# EAGLE design EthernetBoard (EAGLE 5.11)
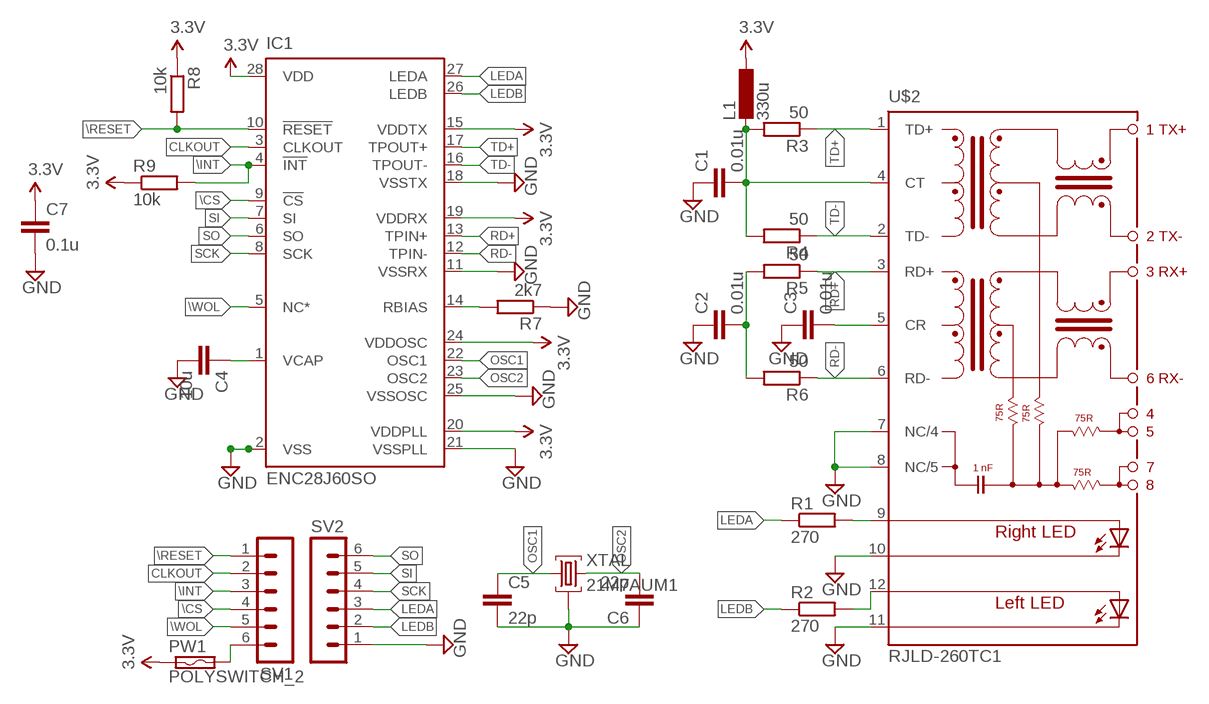
[diagram p0: schematic, sheet 1]

## Parts
C1  0.01u  C-EUC3216  [C3216]
C2  0.01u  C-EUC3216  [C3216]
C3  0.01u  C-EUC3216  [C3216]
C4  10u  C-EUC3216  [C3216]
C5  22p  C-EUC3216  [C3216]
C6  22p  C-EUC3216  [C3216]
C7  0.1u  C-EUC3216  [C3216]
IC1  ENC28J60SO  [SO28W]
L1  330u  L-EUL3216C  [L3216C]
PW1  POLYSWITCH_2  [0204/5]
R1  270  R-EU_M3216  [M3216]
R2  270  R-EU_M3216  [M3216]
R3  50  R-EU_M3216  [M3216]
R4  50  R-EU_M3216  [M3216]
R5  50  R-EU_M3216  [M3216]
R6  50  R-EU_M3216  [M3216]
R7  2k7  R-EU_M3216  [M3216]
R8  10k  R-EU_M3216  [M3216]
R9  10k  R-EU_M3216  [M3216]
SV1  MA06-1  [MA06-1]
SV2  MA06-1  [MA06-1]
U$2  RJLD-260TC1  [RJLD-260TC1]
XTAL  21M7AUM1  [UM1]

## Nets
3.3V [power]: C7.1 IC1.15(VDDTX) IC1.19(VDDRX) IC1.20(VDDPLL) IC1.24(VDDOSC) IC1.28(VDD) L1.1 PW1.1 R8.1 R9.1
\CS: IC1.9(!CS) SV1.4
\INT: IC1.4(!INT) R9.2 SV1.3
\RESET: IC1.10(!RESET) R8.2 SV1.1
\WOL: IC1.5(NC*) SV1.5
CLKOUT: IC1.3(CLKOUT) SV1.2
GND [power]: C1.1 C2.1 C3.1 C4.2 C5.2 C6.1 C7.2 IC1.2(VSS) IC1.11(VSSRX) IC1.18(VSSTX) IC1.21(VSSPLL) IC1.25(VSSOSC) R7.1 SV2.1 U$2.7(NC/4) U$2.8(NC/5) U$2.10(C-R) U$2.11(C-L) XTAL.2
LEDA: IC1.27(LEDA) R1.1 SV2.3
LEDB: IC1.26(LEDB) R2.1 SV2.2
N$1: R1.2 U$2.9(A-R)
N$2: R2.2 U$2.12(AL)
N$3: C3.2 U$2.5(CR)
N$4: IC1.14(RBIAS) R7.2
N$5: C1.2 L1.2 R3.2 R4.2 U$2.4(CT)
N$6: C2.2 R5.2 R6.2
N$7: C4.1 IC1.1(VCAP)
N$8 [power]: PW1.2 SV1.6
OSC1: C5.1 IC1.22(OSC1) XTAL.1
OSC2: C6.2 IC1.23(OSC2) XTAL.3
RD+: IC1.13(TPIN+) R5.1 U$2.3(RD+)
RD-: IC1.12(TPIN-) R6.1 U$2.6(RD-)
SCK: IC1.8(SCK) SV2.4
SI: IC1.7(SI) SV2.5
SO: IC1.6(SO) SV2.6
TD+: IC1.17(TPOUT+) R3.1 U$2.1(TD+)
TD-: IC1.16(TPOUT-) R4.1 U$2.2(TD-)

## Library data of the parts
C1-C7 = rcl:C-EU: CAPACITOR, European symbol
IC1 = microchip-6:ENC28J60: Stand-Alone Ethernet Controller with SPI Interface Source: http://ww1.microchip.com/downloads/en/DeviceDoc/39662c.pdf
L1 = rcl:L-EU: INDUCTOR, European symbol
PW1 = myparts:POLYSWITCH_2
R1-R9 = rcl:R-EU_: RESISTOR, European symbol
SV1 SV2 = con-lstb:MA06-1: PIN HEADER; OC_FARNELL: unknown; OC_NEWARK: unknown
U$2 = myparts:RJLD-260TC1
XTAL = crystal:21M*A: Monolithic Crystal Filters Source: www.vanlong.com; OC_FARNELL: unknown; OC_NEWARK: unknown

## Net classes
1 power: width 0.254 mm

## Board
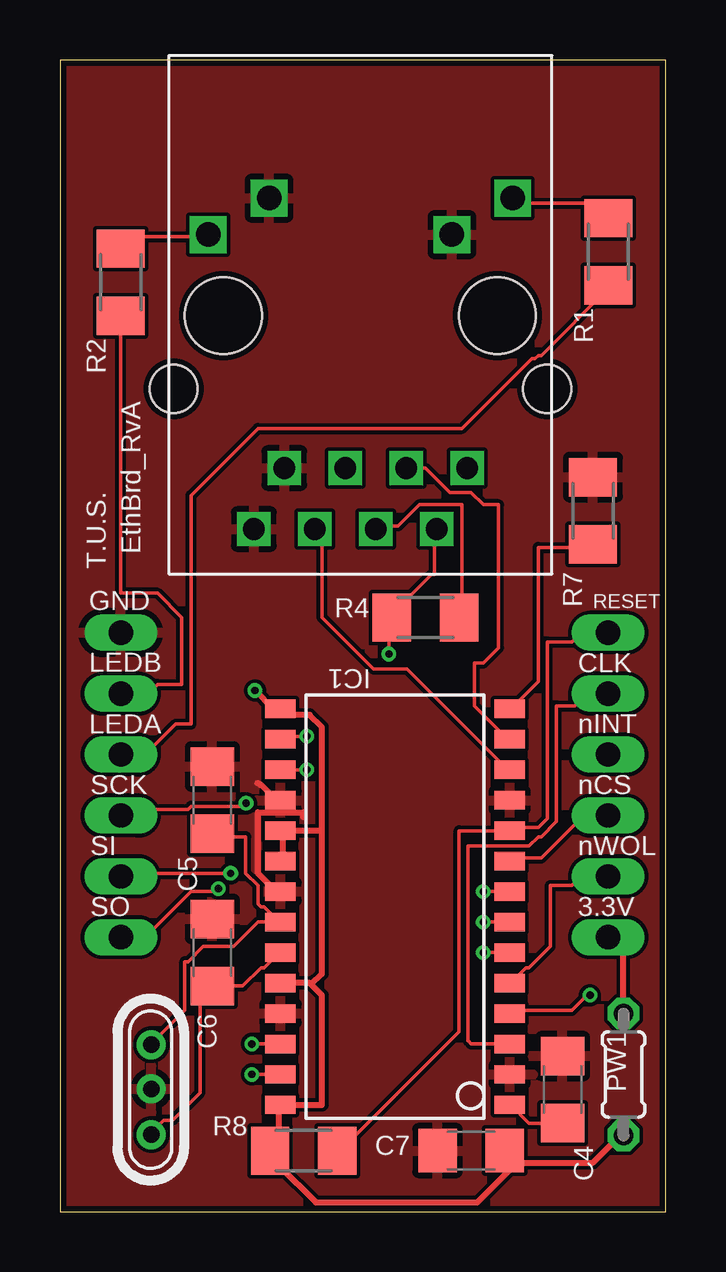
[diagram p1: board, top side]
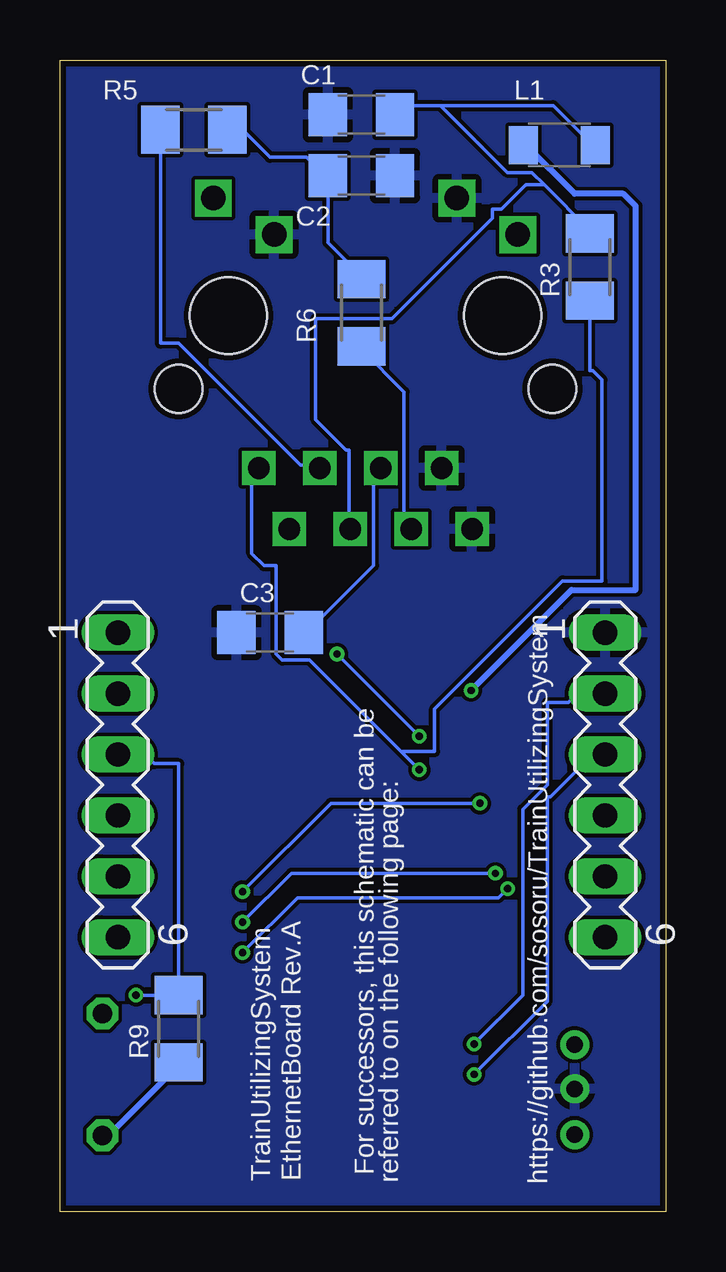
[diagram p2: board, bottom side, seen from below]

Size 25.27 x 48 mm. Coordinates in mm from the lower left corner, seen from the top.
Outline: 0,0 25.27,0 25.27,48 0,48 0,0
Copper layers (1*16): Top 0.035mm / dielectric 1.5mm / Bottom 0.035mm
Design rules "Fusion_eagle_rule_v1.1": minimum track width 6mil, minimum drill 12mil, track to track 6mil, track to pad 6mil, pad to pad 6mil, via to via 6mil, smd to smd 0mil, copper to edge 10mil, drill to drill 10mil, minimum pad ring 10mil, minimum via ring 6mil, stop-mask expansion 2mil, vias tented up to drill 100mil, thermal gap 10mil

### Footprints (pad centres in the part's own frame; a part is rotated, then mirrored left to right if it is on the bottom)
C3216 = smd 1.6 x 1.8: 1 -1.4,0; 2 1.4,0
SO28W = smd 0.762 x 1.27: 1 -7.62,-4.78; 2 -6.35,-4.78; 3 -5.08,-4.78; 4 -3.81,-4.78; 5 -2.54,-4.78; 6 -1.27,-4.78; 7 0,-4.78; 8 1.27,-4.78; 9 2.54,-4.78; 10 3.81,-4.78; 11 5.08,-4.78; 12 6.35,-4.78; 13 7.62,-4.78; 14 8.89,-4.78; 15 8.89,4.78; 16 7.62,4.78; 17 6.35,4.78; 18 5.08,4.78; 19 3.81,4.78; 20 2.54,4.78; 21 1.27,4.78; 22 0,4.78; 23 -1.27,4.78; 24 -2.54,4.78; 25 -3.81,4.78; 26 -5.08,4.78; 27 -6.35,4.78; 28 -7.62,4.78
L3216C = smd 1.2 x 1.6: 1 -1.5,0; 2 1.5,0
0204/5 = drill 0.813 octagon: 1 -2.54,0; 2 2.54,0
M3216 = smd 1.6 x 2: 1 -1.4,0; 2 1.4,0
MA06-1 = drill 1.016 long: 1 -6.35,0; 2 -3.81,0; 3 -1.27,0; 4 1.27,0; 5 3.81,0; 6 6.35,0
RJLD-260TC1 = drill 0.9 square: 1 3.345,3.3; 2 4.615,5.84; 3 5.885,3.3; 4 7.155,5.84; 5 8.425,3.3; 6 9.695,5.84; 7 10.965,3.3; 8 12.235,5.84 | drill 1.02 square: 9 1.44,-7.95; 10 3.98,-6.43; 11 11.6,-7.95; 12 14.14,-6.43 | hole 2: 0,0; 15.58,0 | hole 3.2: 2.075,-3.05; 13.505,-3.05
UM1 = drill 0.7 pad 1.2 round: 1 -1.875,0; 2 -0.027,0; 3 1.875,0

### Placement (x,y rotation side)
C1  12.7,45.72 0 bottom
C2  12.7,43.18 180 bottom
C3  16.51,24.13 0 bottom
C4  20.95,5.08 90 top
C5  6.35,17.14 90 top
C6  6.35,10.79 270 top
C7  17.14,2.54 180 top
IC1  13.97,12.06 90 top
L1  4.45,44.45 0 bottom
PW1  23.5,5.71 90 top
R1  22.86,40.01 90 top
R2  2.54,38.73 90 top
R3  3.17,39.37 90 bottom
R4  15.24,24.77 0 top
R5  19.68,45.09 0 bottom
R6  12.7,37.47 90 bottom
R7  22.23,29.21 270 top
R8  10.16,2.54 0 top
R9  20.32,7.62 90 bottom
SV1  22.86,17.78 270 bottom
SV2  2.54,17.78 270 bottom
U$2  20.32,34.29 180 top
XTAL  3.81,5.08 270 top

### Tracks (layer width: path | path; a pad name or v marks a point on that pad's centre or on a via)
3.3V  (via drill 0.3)
  Top 0.254: PW1.1 23.37,3.17 22.23,2.03 19.18,2.03 18.67,2.54 C7.1 19.05,2.03 17.4,0.38 10.67,0.38 9.14,1.91 9.14,2.54 | 9.14,2.54 9.14,4.45 IC1.28 10.92,4.45 10.92,9.02 10.48,9.46 | 9.14,2.54 R8.1 | 10.48,9.46 10.41,9.53 IC1.24 | 9.27,15.88 9.27,14.61 IC1.20 | 10.92,15.88 10.92,20.19 10.41,20.7 9.53,20.7 9.27,20.95 IC1.15 8.89,20.95 v8.13,21.72 | 10.92,15.88 9.27,15.88 | 9.27,15.88 IC1.19 | 10.92,15.88 10.92,9.91 10.48,9.46
  Bottom 0.254: v8.13,21.72 3.94,25.91 1.27,25.91 1.27,41.91 1.78,42.42 3.81,42.42 5.84,44.45 L1.1 | PW1.1 23.24,3.17 20.32,6.1 R9.1
\CS
  Top 0.152: SV1.4 21.84,16.51 20.07,14.73 18.92,14.73 18.8,14.61 IC1.9
\INT  (via drill 0.3)
  Top 0.152: v22.1,9.02 21.97,9.02 21.34,8.38 18.92,8.38 18.8,8.26 IC1.4
  Bottom 0.152: v22.1,9.02 R9.2 20.32,18.67 21.34,18.67 21.72,19.05 SV1.3
\RESET
  Top 0.152: SV1.1 21.72,24.13 21.34,23.75 20.32,23.75 20.32,16.38 19.94,16 18.92,16 18.8,15.88 IC1.10 16.64,15.88 16.64,7.49 11.68,2.54 R8.2
\WOL
  Top 0.152: SV1.5 21.72,13.97 21.34,13.59 20.45,13.59 20.45,11.05 19.56,10.16 19.43,10.16 18.8,9.53 IC1.5
CLKOUT
  Top 0.152: IC1.3 17.14,6.99 17.05,7.1 17.02,7.11 17.02,15.24 19.56,15.24 19.94,15.62 20.07,15.62 20.7,16.26 20.7,21.08 21.46,21.08 21.97,21.59 SV1.2
GND
  Top 0.254: IC1.21 9.02,13.34 8.26,14.1 8.26,16.64 10.16,16.64 10.15,16.44 | IC1.18 9.02,17.14 8.38,17.78 8.23,17.85
  pour Bottom: 0,48.26 0,0 25.4,0 25.4,48.26
  pour Top: -1.27,49.53 -1.27,-1.27 27.94,-1.27 26.67,49.53
LEDA  (via drill 0.3)
  Top 0.152: v8,5.71 IC1.27 | SV2.3 3.56,19.05 4.83,20.32 5.46,20.32 5.46,29.84 8.26,32.64 16.76,32.64 19.68,35.56 19.81,35.56 19.94,35.69 20.07,35.69 22.86,38.48 R1.1
  Bottom 0.152: v8,5.71 4.95,8.76 4.95,17.27 4.83,17.27 3.05,19.05 SV2.3
LEDB  (via drill 0.3)
  Top 0.152: IC1.26 v8,6.99 | SV2.2 3.68,21.59 4.06,21.97 5.08,21.97 5.08,24.77 4.06,25.78 2.54,25.78 R2.1
  Bottom 0.152: v8,6.99 5.97,9.02 5.97,16.76 4.95,17.78 4.95,21.21 4.06,21.21 3.68,21.59 SV2.2
N$1
  Top 0.152: R1.2 22.86,41.53 22.35,42.04 19.05,42.04 18.92,42.16 U$2.9
N$2
  Top 0.152: R2.2 2.54,40.26 2.92,40.64 6.1,40.64 U$2.12
N$3
  Bottom 0.152: C3.2 14.99,24.13 12.19,26.92 12.19,30.99 11.94,30.99 U$2.5
N$4
  Top 0.152: IC1.14 18.8,20.95 19.94,22.1 19.94,27.69 22.23,27.69 R7.2
N$5
  Top 0.152: R4.2 16.76,24.77 16.76,29.46 14.99,29.46 14.1,28.57 13.21,28.57 U$2.4
  Bottom 0.152: 9.4,46.1 10.79,46.1 11.18,45.72 C1.2 | 9.4,46.1 4.7,46.1 3.05,44.45 L1.2 | 5.08,42.8 5.59,43.31 6.6,43.31 9.4,46.1 | 5.08,42.8 3.17,40.89 R3.2 | 5.08,42.8 5.84,42.8 6.86,41.78 7.24,41.78 7.24,41.4 11.43,37.21 14.61,37.21 14.61,33.02 13.34,31.75 13.21,31.75 13.21,28.57 U$2.4
N$6
  Bottom 0.152: R5.2 17.65,45.09 16.51,43.94 14.99,43.94 14.22,43.18 C2.2 14.1,40.39 12.7,38.99 R6.2
N$7
  Top 0.152: IC1.1 18.8,4.45 19.56,3.68 C4.1
N$8
  Top 0.254: PW1.2 23.5,11.43 SV1.6
OSC1
  Top 0.152: 9.14,12.06 8.51,12.7 8.38,12.7 8.26,12.83 8.26,13.59 7.75,14.1 7.75,15.62 6.35,15.62 C5.1 | 9.14,12.06 8.26,12.06 7.24,11.05 5.97,11.05 5.33,10.41 5.21,10.41 5.21,8.38 3.81,6.99 XTAL.1 | 9.14,12.06 IC1.22
OSC2
  Top 0.152: IC1.23 9.14,10.79 8.51,10.16 8.38,10.16 7.62,9.4 C6.2 6.35,9.27 5.84,9.27 5.84,4.95 4.7,3.81 4.32,3.81 3.81,3.3 XTAL.3
RD+
  Top 0.152: IC1.13 18.67,19.68 17.27,21.08 17.27,22.86 17.65,22.86 18.29,23.5 18.29,29.46 17.65,29.46 17.14,29.97 16.26,29.97 15.24,30.99 14.48,30.99 U$2.3
  Bottom 0.152: R5.1 21.08,36.2 20.32,36.2 15.24,31.11 14.48,31.11 U$2.3
RD-
  Top 0.152: IC1.12 18.67,18.41 14.48,22.61 13.08,22.61 10.92,24.77 10.92,28.45 10.67,28.45 U$2.6
  Bottom 0.152: R6.1 12.7,35.94 10.92,34.16 10.92,28.57 10.67,28.57 U$2.6
SCK  (via drill 0.3)
  Top 0.152: v17.65,13.34 IC1.8 | SV2.4 2.79,16.76 5.33,16.76 5.46,16.89 7.62,16.89 7.75,17.02 v7.76,17.02
  Bottom 0.152: v17.65,13.34 13.97,17.02 v7.76,17.02
SI  (via drill 0.3)
  Top 0.152: v7.11,14.1 2.67,14.1 SV2.5 | v17.65,12.06 IC1.7
  Bottom 0.152: v17.65,12.06 15.62,14.1 v7.11,14.1
SO  (via drill 0.3)
  Top 0.152: v6.6,13.46 6.48,13.34 5.46,13.34 3.56,11.43 SV2.6 | v17.65,10.79 IC1.6
  Bottom 0.152: v17.65,10.79 15.37,13.08 6.99,13.08 v6.6,13.46
TD+  (via drill 0.3)
  Top 0.152: IC1.17 v10.29,18.41
  Bottom 0.152: 11.05,19.18 14.86,22.99 16,22.99 16.26,23.24 16.26,26.92 16.76,26.92 17.27,27.43 17.27,30.99 17.02,30.99 U$2.1 | v10.29,18.41 11.05,19.18 | 11.05,19.18 9.65,19.18 9.65,20.95 4.32,26.29 2.67,26.29 2.67,34.67 3.05,35.05 3.17,35.05 R3.1
TD-  (via drill 0.3)
  Top 0.152: v10.29,19.81 9.4,19.81 9.27,19.68 IC1.16 | v13.72,23.24 13.72,24.77 | 13.72,24.77 15.49,26.54 15.62,26.54 15.62,28.45 U$2.2 | 13.72,24.77 R4.1
  Bottom 0.152: v10.29,19.81 v13.72,23.24

### Text on the board
tNames: EthBrd_RvA | T.U.S. | GND | RESET | LEDB | CLK | LEDA | nINT | SCK | nCS | SI | nWOL | SO | 3.3V
bNames: For successors, this schematic can be | https://github.com/sosoru/TrainUtilizingSystem | referred to on the following page: | EthernetBoard Rev.A | TrainUtilizingSystem